# Altium schematic sheet Block_GPIOs, USB2.0, I2S, SPI, GBe and CSI.SchDoc
size A3; SheetNumber: 3; SheetTotal: 16
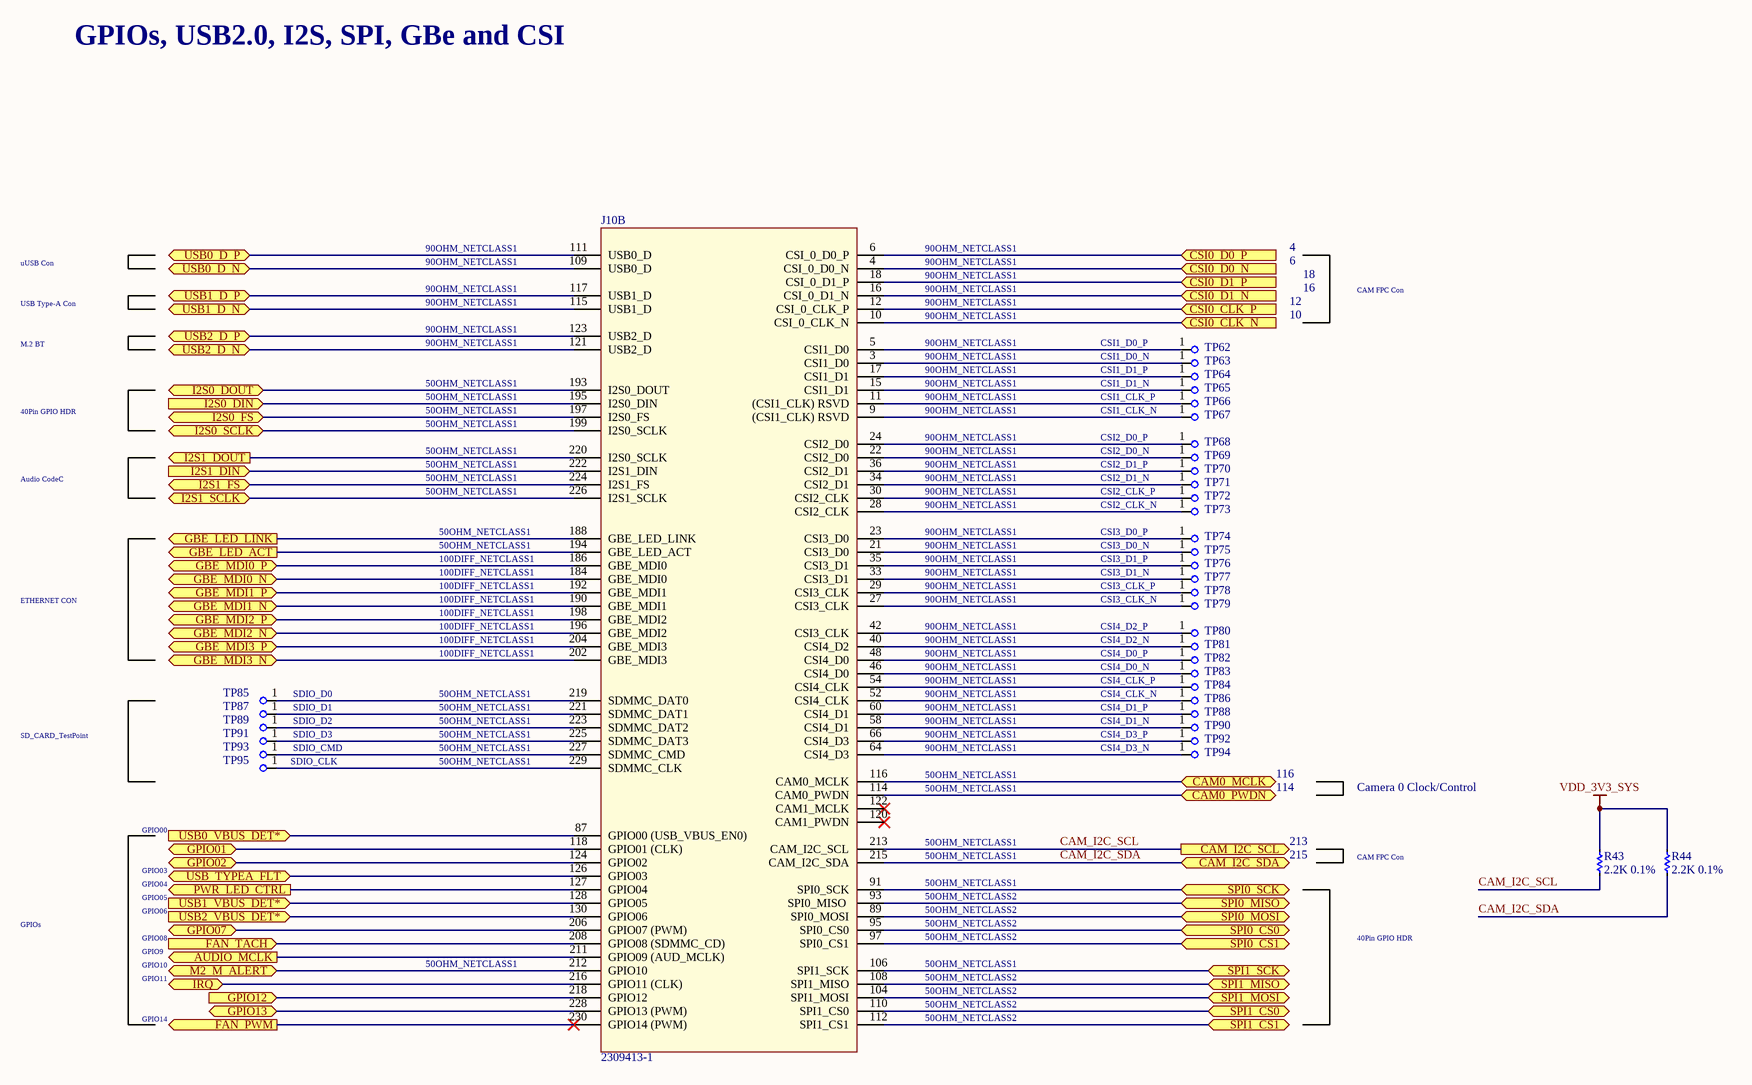
[diagram p0: Block_GPIOs, USB2.0, I2S, SPI, GBe and CSI.SchDoc]

## Parts
J10  2309413-1  [2309413-1]  (part B of 3)
R43  2.2K 0.1%  [R0603]
R44  2.2K 0.1%  [R0603]
TP62  CSI1_D0_P  [TestPoint_Pad_D1.0mm]
TP63  CSI1_D0_N  [TestPoint_Pad_D1.0mm]
TP64  CSI1_D1_P  [TestPoint_Pad_D1.0mm]
TP65  CSI1_D1_N  [TestPoint_Pad_D1.0mm]
TP66  CSI1_CLK_P  [TestPoint_Pad_D1.0mm]
TP67  CSI1_CLK_N  [TestPoint_Pad_D1.0mm]
TP68  CSI2_D0_P  [TestPoint_Pad_D1.0mm]
TP69  CSI2_D0_N  [TestPoint_Pad_D1.0mm]
TP70  CSI2_D1_P  [TestPoint_Pad_D1.0mm]
TP71  CSI2_D1_N  [TestPoint_Pad_D1.0mm]
TP72  CSI2_CLK_P  [TestPoint_Pad_D1.0mm]
TP73  CSI2_CLK_N  [TestPoint_Pad_D1.0mm]
TP74  CSI3_D0_P  [TestPoint_Pad_D1.0mm]
TP75  CSI3_D0_N  [TestPoint_Pad_D1.0mm]
TP76  CSI3_D1_P  [TestPoint_Pad_D1.0mm]
TP77  CSI3_D1_N  [TestPoint_Pad_D1.0mm]
TP78  CSI3_CLK_P  [TestPoint_Pad_D1.0mm]
TP79  CSI3_CLK_N  [TestPoint_Pad_D1.0mm]
TP80  CSI4_D2_P  [TestPoint_Pad_D1.0mm]
TP81  CSI4_D2_N  [TestPoint_Pad_D1.0mm]
TP82  CSI4_D0_P  [TestPoint_Pad_D1.0mm]
TP83  CSI4_D0_N  [TestPoint_Pad_D1.0mm]
TP84  CSI4_CLK_P  [TestPoint_Pad_D1.0mm]
TP85  SDIO_D0  [TestPoint_Pad_D1.0mm]
TP86  CSI4_CLK_N  [TestPoint_Pad_D1.0mm]
TP87  SDIO_D1  [TestPoint_Pad_D1.0mm]
TP88  CSI4_D1_P  [TestPoint_Pad_D1.0mm]
TP89  SDIO_D2  [TestPoint_Pad_D1.0mm]
TP90  CSI4_D1_N  [TestPoint_Pad_D1.0mm]
TP91  SDIO_D3  [TestPoint_Pad_D1.0mm]
TP92  CSI4_D3_P  [TestPoint_Pad_D1.0mm]
TP93  SDIO_CMD  [TestPoint_Pad_D1.0mm]
TP94  CSI4_D3_N  [TestPoint_Pad_D1.0mm]
TP95  SDIO_CLK  [TestPoint_Pad_D1.0mm]

## Ports
AUDIO_MCLK (out), CAM0_MCLK (bidir), CAM0_PWDN (bidir), CAM_I2C_SCL (out), CAM_I2C_SDA (bidir), CSI0_CLK_N (in), CSI0_CLK_P (in), CSI0_D0_N (in), CSI0_D0_P (in), CSI0_D1_N (in), CSI0_D1_P (in), FAN_PWM (out), FAN_TACH (in), GBE_LED_ACT (out), GBE_LED_LINK (out), GBE_MDI0_N (bidir), GBE_MDI0_P (bidir), GBE_MDI1_N (bidir), GBE_MDI1_P (bidir), GBE_MDI2_N (bidir), GBE_MDI2_P (bidir), GBE_MDI3_N (bidir), GBE_MDI3_P (bidir), GPIO01 (bidir), GPIO02 (bidir), GPIO07 (bidir), GPIO12 (in), GPIO13 (bidir), I2S0_DIN (in), I2S0_DOUT (bidir), I2S0_FS (bidir), I2S0_SCLK (bidir), I2S1_DIN (in), I2S1_DOUT (out), I2S1_FS (bidir), I2S1_SCLK (bidir), IRQ (bidir), M2_M_ALERT (bidir), PWR_LED_CTRL (out), SPI0_CS0 (bidir), SPI0_CS1 (bidir), SPI0_MISO (bidir), SPI0_MOSI (bidir), SPI0_SCK (bidir), SPI1_CS0 (bidir), SPI1_CS1 (bidir), SPI1_MISO (bidir), SPI1_MOSI (bidir), SPI1_SCK (bidir), USB0_D_N (bidir), USB0_D_P (bidir), USB0_VBUS_DET* (in), USB1_D_N (bidir), USB1_D_P (bidir), USB1_VBUS_DET* (in), USB2_D_N (bidir), USB2_D_P (bidir), USB2_VBUS_DET* (in), USB_TYPEA_FLT (bidir)

## Nets
VDD_3V3_SYS: R43.2 R44.2
AUDIO_MCLK: J10.211(GPIO09_(AUD_MCLK)) ; port AUDIO_MCLK
CAM0_MCLK: J10.116(CAM0_MCLK) ; port CAM0_MCLK
CAM0_PWDN: J10.114(CAM0_PWDN) ; port CAM0_PWDN
CAM_I2C_SCL: J10.213(CAM_I2C_SCL) R43.1 ; port CAM_I2C_SCL
CAM_I2C_SDA: J10.215(CAM_I2C_SDA) R44.1 ; port CAM_I2C_SDA
CSI0_CLK_N: J10.10(CSI_0_CLK_N) ; port CSI0_CLK_N
CSI0_CLK_P: J10.12(CSI_0_CLK_P) ; port CSI0_CLK_P
CSI0_D0_N: J10.4(CSI_0_D0_N) ; port CSI0_D0_N
CSI0_D0_P: J10.6(CSI_0_D0_P) ; port CSI0_D0_P
CSI0_D1_N: J10.16(CSI_0_D1_N) ; port CSI0_D1_N
CSI0_D1_P: J10.18(CSI_0_D1_P) ; port CSI0_D1_P
FAN_PWM: J10.230(GPIO14_(PWM)) ; port FAN_PWM
FAN_TACH: J10.208(GPIO08_(SDMMC_CD)) ; port FAN_TACH
GBE_LED_ACT: J10.194(GBE_LED_ACT) ; port GBE_LED_ACT
GBE_LED_LINK: J10.188(GBE_LED_LINK) ; port GBE_LED_LINK
GBE_MDI0_N: J10.184(GBE_MDI0) ; port GBE_MDI0_N
GBE_MDI0_P: J10.186(GBE_MDI0) ; port GBE_MDI0_P
GBE_MDI1_N: J10.190(GBE_MDI1) ; port GBE_MDI1_N
GBE_MDI1_P: J10.192(GBE_MDI1) ; port GBE_MDI1_P
GBE_MDI2_N: J10.196(GBE_MDI2) ; port GBE_MDI2_N
GBE_MDI2_P: J10.198(GBE_MDI2) ; port GBE_MDI2_P
GBE_MDI3_N: J10.202(GBE_MDI3) ; port GBE_MDI3_N
GBE_MDI3_P: J10.204(GBE_MDI3) ; port GBE_MDI3_P
GPIO01: J10.118(GPIO01_(CLK)) ; port GPIO01
GPIO02: J10.124(GPIO02) ; port GPIO02
GPIO07: J10.206(GPIO07_(PWM)) ; port GPIO07
GPIO12: J10.218(GPIO12) ; port GPIO12
GPIO13: J10.228(GPIO13_(PWM)) ; port GPIO13
I2S0_DIN: J10.195(I2S0_DIN) ; port I2S0_DIN
I2S0_DOUT: J10.193(I2S0_DOUT) ; port I2S0_DOUT
I2S0_FS: J10.197(I2S0_FS) ; port I2S0_FS
I2S0_SCLK: J10.199(I2S0_SCLK) ; port I2S0_SCLK
I2S1_DIN: J10.222(I2S1_DIN) ; port I2S1_DIN
I2S1_DOUT: J10.220(I2S0_SCLK) ; port I2S1_DOUT
I2S1_FS: J10.224(I2S1_FS) ; port I2S1_FS
I2S1_SCLK: J10.226(I2S1_SCLK) ; port I2S1_SCLK
IRQ: J10.216(GPIO11_(CLK)) ; port IRQ
M2_M_ALERT: J10.212(GPIO10) ; port M2_M_ALERT
PWR_LED_CTRL: J10.127(GPIO04) ; port PWR_LED_CTRL
SPI0_CS0: J10.95(SPI0_CS0) ; port SPI0_CS0
SPI0_CS1: J10.97(SPI0_CS1) ; port SPI0_CS1
SPI0_MISO: J10.93(SPI0_MISO) ; port SPI0_MISO
SPI0_MOSI: J10.89(SPI0_MOSI) ; port SPI0_MOSI
SPI0_SCK: J10.91(SPI0_SCK) ; port SPI0_SCK
SPI1_CS0: J10.110(SPI1_CS0) ; port SPI1_CS0
SPI1_CS1: J10.112(SPI1_CS1) ; port SPI1_CS1
SPI1_MISO: J10.108(SPI1_MISO) ; port SPI1_MISO
SPI1_MOSI: J10.104(SPI1_MOSI) ; port SPI1_MOSI
SPI1_SCK: J10.106(SPI1_SCK) ; port SPI1_SCK
USB0_D_N: J10.109(USB0_D) ; port USB0_D_N
USB0_D_P: J10.111(USB0_D) ; port USB0_D_P
USB0_VBUS_DET*: J10.87(GPIO00_(USB_VBUS_EN0)) ; port USB0_VBUS_DET*
USB1_D_N: J10.115(USB1_D) ; port USB1_D_N
USB1_D_P: J10.117(USB1_D) ; port USB1_D_P
USB1_VBUS_DET*: J10.128(GPIO05) ; port USB1_VBUS_DET*
USB2_D_N: J10.121(USB2_D) ; port USB2_D_N
USB2_D_P: J10.123(USB2_D) ; port USB2_D_P
USB2_VBUS_DET*: J10.130(GPIO06) ; port USB2_VBUS_DET*
USB_TYPEA_FLT: J10.126(GPIO03) ; port USB_TYPEA_FLT
NetJ10_3: J10.3(CSI1_D0) TP63.1
NetJ10_5: J10.5(CSI1_D0) TP62.1
NetJ10_9: J10.9((CSI1_CLK)_RSVD) TP67.1
NetJ10_11: J10.11((CSI1_CLK)_RSVD) TP66.1
NetJ10_15: J10.15(CSI1_D1) TP65.1
NetJ10_17: J10.17(CSI1_D1) TP64.1
NetJ10_21: J10.21(CSI3_D0) TP75.1
NetJ10_22: J10.22(CSI2_D0) TP69.1
NetJ10_23: J10.23(CSI3_D0) TP74.1
NetJ10_24: J10.24(CSI2_D0) TP68.1
NetJ10_27: J10.27(CSI3_CLK) TP79.1
NetJ10_28: J10.28(CSI2_CLK) TP73.1
NetJ10_29: J10.29(CSI3_CLK) TP78.1
NetJ10_30: J10.30(CSI2_CLK) TP72.1
NetJ10_33: J10.33(CSI3_D1) TP77.1
NetJ10_34: J10.34(CSI2_D1) TP71.1
NetJ10_35: J10.35(CSI3_D1) TP76.1
NetJ10_36: J10.36(CSI2_D1) TP70.1
NetJ10_40: J10.40(CSI4_D2) TP81.1
NetJ10_42: J10.42(CSI3_CLK) TP80.1
NetJ10_46: J10.46(CSI4_D0) TP83.1
NetJ10_48: J10.48(CSI4_D0) TP82.1
NetJ10_52: J10.52(CSI4_CLK) TP86.1
NetJ10_54: J10.54(CSI4_CLK) TP84.1
NetJ10_58: J10.58(CSI4_D1) TP90.1
NetJ10_60: J10.60(CSI4_D1) TP88.1
NetJ10_64: J10.64(CSI4_D3) TP94.1
NetJ10_66: J10.66(CSI4_D3) TP92.1
NetJ10_219: J10.219(SDMMC_DAT0) TP85.1
NetJ10_221: J10.221(SDMMC_DAT1) TP87.1
NetJ10_223: J10.223(SDMMC_DAT2) TP89.1
NetJ10_225: J10.225(SDMMC_DAT3) TP91.1
NetJ10_227: J10.227(SDMMC_CMD) TP93.1
NetJ10_229: J10.229(SDMMC_CLK) TP95.1

Not connected (* = marked no-connect by the designer): J10 120(CAM1_PWDN)* 122(CAM1_MCLK)*

## Notes on the sheet
- GPIOs, USB2.0, I2S, SPI, GBe and CSI
- uUSB Con
- 90OHM_NETCLASS1
- 4
- 6
- 18
- USB Type-A Con
- M.2 BT
- 10
- 12
- 16
- CAM FPC Con
- 40Pin GPIO HDR
- 50OHM_NETCLASS1
- Audio CodeC
- ETHERNET CON
- 100DIFF_NETCLASS1
- SD_CARD_TestPoint
- 114
- 116
- Camera 0 Clock/Control
- GPIO04
- GPIO00
- GPIO03
- 213
- 215
- GPIOs
- GPIO9
- GPIO08
- GPIO05
- GPIO06
- 50OHM_NETCLASS2
- GPIO10
- GPIO11
- GPIO14

## Library data of the parts
J10 = 2309413-1: Conn DDR4 DIMM Socket SKT 260 POS 0.5mm Solder RA SMD T/R; Manufacturer: TE Connectivity; Supplier 1: Mouser; Manufacturer Part Number: 2309413-1; RoHS: Yes; Category: Memory Connectors; Stock 1: 11271; Pricing 1: 1=1.81000, 10=1.54000, 50=1.54000, 100=1.47000, 1000=1.16000, 10000=1.15000 (USD); ComponentLink1URL: https://www.te.com/commerce/DocumentDelivery/DDEController?Action=srchrtrv&DocNm=2309413&DocType=Customer+Drawing&DocLang=English&src-supplier=Digi-Key; ComponentLink1Description: https://www.te.com/commerce/DocumentDelivery/DDEController?Action=srchrtrv&DocNm=2309413&DocType=Customer+Drawing&DocLang=English&src-supplier=Digi-Key; ComponentLink2URL: https://www.te.com/commerce/DocumentDelivery/DDEController?Action=srchrtrv&amp;DocNm=2309413&amp;DocType=Customer+Drawing&amp;DocLang=English&src-supplier=Digi-Key; ComponentLink2Description: https://www.te.com/commerce/DocumentDelivery/DDEController?Action=srchrtrv&amp;DocNm=2309413&amp;DocType=Customer+Drawing&amp;DocLang=English&src-supplier=Digi-Key; Supplier Part Number 1: 571-2309413-1
R43 R44 = CPF0603B2K2E1: Res Thin Film 0603 2.2K Ohm 0.1% 1/16W ±25ppm/°C Molded SMD SMD Paper T/R; Manufacturer: TE Connectivity Neohm; Resistance: 2.2kR; Power Rating: 63mW; Voltage Rating: 50V; Voltage Rating (DC): 120V; Number of Resistors: 1; Supplier 1: Digi-Key; Manufacturer Part Number: CPF0603B2K2E1; RoHS: Yes; Category: Chip SMD Resistors; Stock 1: 150750; Pricing 1: 1=0.69000, 10=0.49000, 100=0.25450, 500=0.17622 (USD); Mount: Surface Mount; Case/Package: 0603; Number of Pins: 2; Case Code (Imperial): 0603; Case Code (Metric): 1608; Weight: 7.1E-05oz; Min Operating Temperature: -55°C; Max Operating Temperature: 155°C; Tolerance: 0.1%; Packaging: Tape and Reel; Resistor Type: Thin Film; Package Quantity: 1000; Termination: Solder; Temperature Coefficient: 25ppm/°C; Number of Terminations: 2; Series: CPF; Resistance Tolerance: 0.1%; Length: 1.55mm; Width: 0.8mm; Height: 0.45mm; Radiation Hardening: No; Reach SVHC Compliant: Yes; ELV: Compliant; RoHS Compliant: Yes; ComponentLink1URL: https://datasheet.ciiva.com/7789/eng-ds-1773200-j-7789503.pdf?src-supplier=Element14; ComponentLink1Description: https://datasheet.ciiva.com/7789/eng-ds-1773200-j-7789503.pdf?src-supplier=Element14; Supplier Part Number 1: A103077DKR-ND
TP62-TP95 = TestPoint_D1mm